# EAGLE design Adafruit 128x32 Pi OLED (EAGLE 6.4)
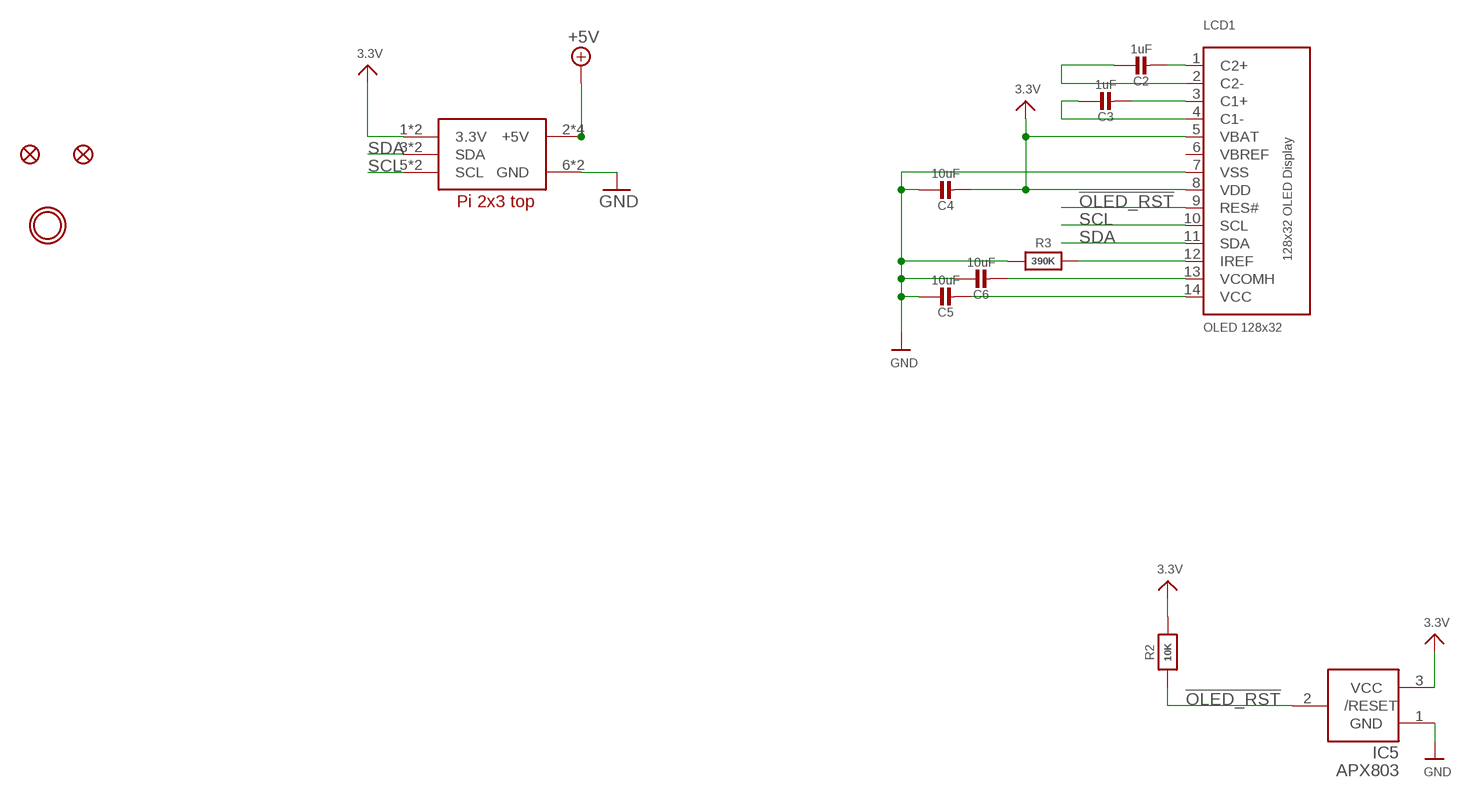
[diagram p0: schematic, sheet 1]

## Parts
C2  1uF  CAP_CERAMIC0805-NOOUTLINE  [0805-NO]
C3  1uF  CAP_CERAMIC0805-NOOUTLINE  [0805-NO]
C4  10uF  CAP_CERAMIC0805-NOOUTLINE  [0805-NO]
C5  10uF  CAP_CERAMIC0805-NOOUTLINE  [0805-NO]
C6  10uF  CAP_CERAMIC0805-NOOUTLINE  [0805-NO]
FID3  FIDUCIAL_1MM  [FIDUCIAL_1MM]
FID4  FIDUCIAL_1MM  [FIDUCIAL_1MM]
IC5  APX803  AXP083-SAG  [SOT23]
LCD1  OLED 128x32  DISP_OLED_UG-2832HSWEG02  [UG-2832HSWEG02_WRAPUNDER]
R2  10K  RESISTOR0805_NOOUTLINE  [0805-NO]
R3  390K  RESISTOR0805_NOOUTLINE  [0805-NO]
RPI1  RASPBERRYPI_2X3  [RASPBERRYPI_2X3_THMSMT]
U$4  MOUNTINGHOLE3.0THIN  [MOUNTINGHOLE_3.0_PLATEDTHIN]

## Nets
3.3V: C4.2 IC5.3(VCC) LCD1.5(VBAT) LCD1.8(VDD) R2.2 RPI1.1'(3.3V) RPI1.1(3.3V)
!OLED_RST: IC5.2(/RESET) LCD1.9(RES#) R2.1
+5V: RPI1.2'(+5V) RPI1.2(+5V) RPI1.4'(+5V) RPI1.4(+5V)
GND: C4.1 C5.1 C6.1 IC5.1(GND) LCD1.7(VSS) R3.1 RPI1.6'(GND) RPI1.6(GND)
N$1: C2.2 LCD1.1(C2+)
N$2: C2.1 LCD1.2(C2-)
N$3: C3.2 LCD1.3(C1+)
N$4: C3.1 LCD1.4(C1-)
N$5: C6.2 LCD1.13(VCOMH)
N$6: C5.2 LCD1.14(VCC)
N$7: LCD1.12(IREF) R3.2
SCL: LCD1.10(SCL) RPI1.5'(SCL) RPI1.5(SCL)
SDA: LCD1.11(SDA) RPI1.3'(SDA) RPI1.3(SDA)

## Power pins joined to a net without a drawn wire
VBREF: LCD1.6(VBREF)

## Library data of the parts
C2-C6 = microbuilder:CAP_CERAMIC: Ceramic Capacitors For new designs, use the packages preceded by an '_' character since they are more reliable: The following footprints should be used on most boards: _0402 - Standard footprint for regular board layouts _0603 - Standard footprint for regular board layouts _0805 - Standard footprint for regular board layouts _1206 - Standard footprint for regular board layouts For extremely tight-pitch boards where space is at a premium, the following 'micro-pitch' footprints can be used (smaller pads, no silkscreen outline, etc.): _0402MP - Micro-pitch footprint for very dense/compact boards _0603MP - Micro-pitch footprint for very dense/compact boards _0805MP - Micro-pitch footprint for very dense/compact boards _1206MP - Micro-pitch footprint for very dense/compact boards
FID3 FID4 = microbuilder:FIDUCIAL: Fiducial Alignment Points Various fiducial points for machine vision alignment.; BOM: EXCLUDE
IC5 = adafruit:AXP083
LCD1 = microbuilder:DISP_OLED_UG-2832HSWEG02: 128x32 I2C 0.91" Monochrome OLED Display
R2 R3 = microbuilder:RESISTOR: Resistors For new designs, use the packages preceded by an '_' character since they are more reliable: The following footprints should be used on most boards: _0402 - Standard footprint for regular board layouts _0603 - Standard footprint for regular board layouts _0805 - Standard footprint for regular board layouts _1206 - Standard footprint for regular board layouts For extremely tight-pitch boards where space is at a premium, the following 'micro-pitch' footprints can be used (smaller pads, no silkscreen outline, etc.): _0402MP - Micro-pitch footprint for very dense/compact boards _0603MP - Micro-pitch footprint for very dense/compact boards _0805MP - Micro-pitch footprint for very dense/compact boards _1206MP - Micro-pitch footprint for very dense/compact boards
RPI1 = microbuilder:RASPBERRYPI_2X3
U$4 = microbuilder:MOUNTINGHOLE: Mounting Hole For #2 screws (0.086"/2.18mm width, 0.094"/2.4mm hole) use 2.5mm; BOM: EXCLUDE

## Board
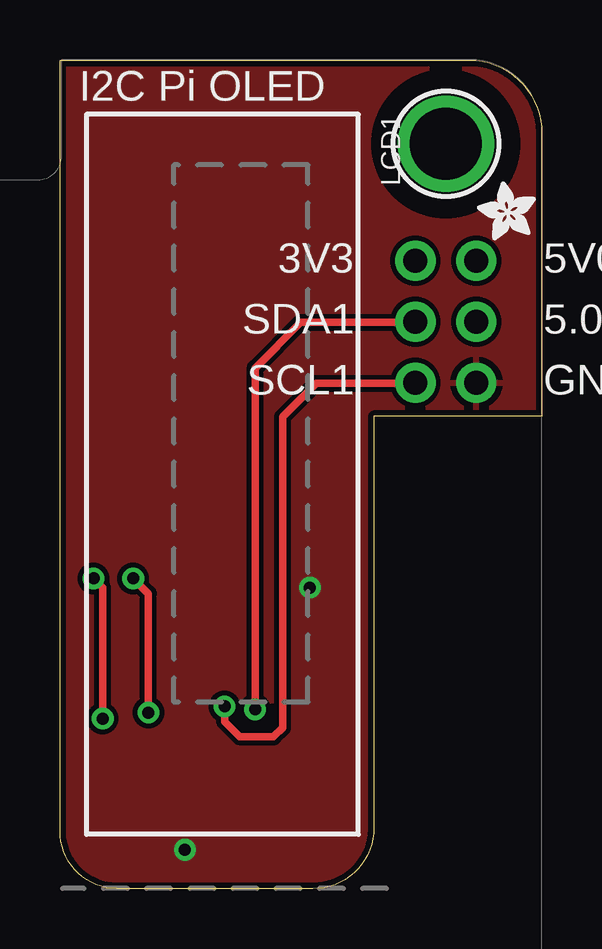
[diagram p1: board, top side]
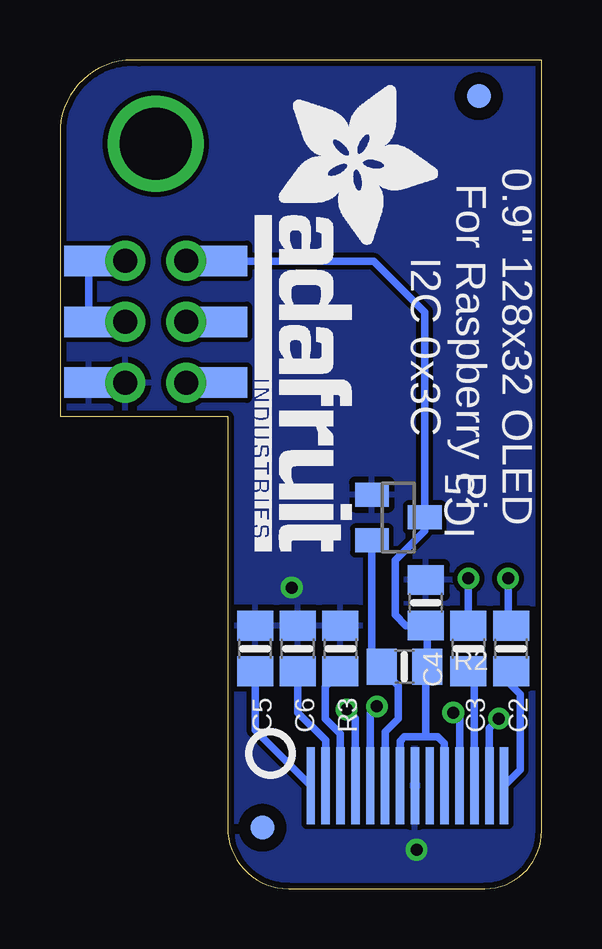
[diagram p2: board, bottom side, seen from below]

Size 20.07 x 34.53 mm. Coordinates in mm from the lower left corner, seen from the top.
Outline: 0,2.41 0,34.52 16.76,34.52 arc-90 20.07,31.72 20.07,19.68 13.08,19.68 13.08,2.54 arc-90 10.54,0 2.36,0 arc-90 0,2.41
Copper layers (1*16): Top 0.035mm / dielectric 1.5mm / Bottom 0.035mm
Design rules "adafruit": minimum track width 8mil, minimum drill 15.5mil, track to track 8mil, track to pad 8mil, pad to pad 8mil, via to via 8mil, smd to smd 8mil, copper to edge 10mil, drill to drill 8mil, minimum pad ring 10mil, minimum via ring 8mil, stop-mask expansion 2mil, vias tented up to drill 20mil, thermal gap 10mil

### Footprints (pad centres in the part's own frame; a part is rotated, then mirrored left to right if it is on the bottom)
0805-NO = smd 1.24 x 1.5: 1 -0.95,0; 2 0.95,0
FIDUCIAL_1MM = smd 1 x 1: 1 0,0
SOT23 = smd 1 x 1.4: 1 -0.95,-1.1; 2 0.95,-1.1; 3 0,1.1
UG-2832HSWEG02_WRAPUNDER = smd 3.2 x 0.35 bottom: 1 -2.03,-5.3; 2 -2.03,-4.68; 3 -2.03,-4.06; 4 -2.03,-3.44; 5 -2.03,-2.82; 6 -2.03,-2.2; 7 -2.03,-1.58; 8 -2.03,-0.96; 9 -2.03,-0.34; 10 -2.03,0.28; 11 -2.03,0.9; 12 -2.03,1.52; 13 -2.03,2.14; 14 -2.03,2.76
RASPBERRYPI_2X3_THMSMT = drill 1 pad 1.676: 1 -1.27,2.54; 2 1.27,2.54; 3 -1.27,0; 4 1.27,0; 5 -1.27,-2.54; 6 1.27,-2.54 | smd 2.032 x 1.27 bottom: 1' -2.794,2.54; 2' 2.794,2.54; 3' -2.794,0; 4' 2.794,0; 5' -2.794,-2.54; 6' 2.794,-2.54
MOUNTINGHOLE_3.0_PLATEDTHIN = drill 3 pad 3.6: P$1 0,0

### Placement (x,y rotation side)
C2  1.27,10.01 270 bottom
C3  3.05,10.01 270 bottom
C4  4.83,11.91 270 bottom
C5  11.94,10.01 270 bottom
C6  10.16,10.01 270 bottom
FID3  11.63,2.54 0 bottom
FID4  2.62,33.02 0 bottom
IC5  5.97,15.47 270 bottom
LCD1  6.86,2.26 270 top
R2  5.71,9.25 0 bottom
R3  8.38,10.01 270 bottom
RPI1  16.08,23.62 0 top
U$1  [ADAFRUIT_2.5MM]  19.81,27.03 90 top
U$3  [PCBFEAT-REV-040]  11.3,5.64 270 bottom
U$4  16.08,31.04 180 top
U$8  [ADAFRUIT_TEXT_20MM]  11.94,33.63 270 bottom

### Tracks (layer width: path | path; a pad name or v marks a point on that pad's centre or on a via)
3.3V
  Bottom 0.305: LCD1.8 5.9,6.14 5.71,6.32 4.83,6.32 | 4.83,6.32 4.32,6.32 4.06,6.07 4.06,4.32 LCD1.5 | 4.83,6.32 4.83,9.18 R2.2 4.76,10.9 C4.2 5.65,10.96 6.1,11.4 6.1,13.69 4.87,14.92 IC5.3 4.87,24.02 6.99,26.14 13.26,26.14 RPI1.1' RPI1.1
!OLED_RST
  Bottom 0.305: LCD1.9 6.52,6.54 6.22,6.83 5.97,7.09 5.97,8.45 6.33,8.82 | 6.22,8.68 6.33,8.82 | 6.33,8.82 R2.1 7.07,9.65 IC5.2
+5V
  Bottom 0.305: RPI1.2 RPI1.2' RPI1.4' RPI1.4
GND  (via drill 0.5)
  other vias: 5.21,1.63 10.41,12.55
  pour Top: 20.02,-0.03 20.27,34.54 -0.18,34.54 -0.05,-0.03
  pour Bottom: 20.02,-0.03 20.27,34.54 -0.18,34.54 -0.05,-0.03
N$1
  Bottom 0.305: LCD1.1 0.89,4.96 0.89,8.1 1.27,8.48 C2.2
N$2  (via drill 0.5)
  Top 0.305: v1.78,7.09 1.78,12.55 v1.4,12.93
  Bottom 0.305: LCD1.2 2.18,6.69 v1.78,7.09 | v1.4,12.93 1.4,11.08 C2.1
N$3
  Bottom 0.305: LCD1.3 2.8,8.81 C3.2
N$4  (via drill 0.5)
  Top 0.305: v3.68,7.34 3.68,12.29 v3.05,12.93
  Bottom 0.305: LCD1.4 3.42,7.08 v3.68,7.34 | v3.05,12.93 C3.1
N$5
  Bottom 0.305: LCD1.13 9,6.18 10.16,7.34 C6.2
N$6
  Bottom 0.305: LCD1.14 11.94,6.61 C5.2
N$7
  Bottom 0.305: LCD1.12 8.38,6.45 9.02,7.09 9.02,8.42 R3.2
SCL  (via drill 0.5)
  Top 0.305: v6.86,7.59 6.86,6.96 7.49,6.32 8.89,6.32 9.27,6.71 9.27,19.66 10.67,21.06 14.78,21.06 RPI1.5
  Bottom 0.305: RPI1.5 RPI1.5' | LCD1.10 7.14,7.31 v6.86,7.59
SDA  (via drill 0.5)
  Top 0.305: v8.13,7.47 8.13,21.69 10.03,23.6 14.78,23.6 RPI1.3
  Bottom 0.305: RPI1.3' RPI1.3 | LCD1.11 7.76,7.1 v8.13,7.47

### Text on the board
tPlace: I2C Pi OLED
bPlace: 0.9" 128x32 OLED / For Raspberry Pi / I2C 0x3C